# Altium schematic sheet 01_Index.SchDoc
size A4; SheetNumber: 1; SheetTotal: 9
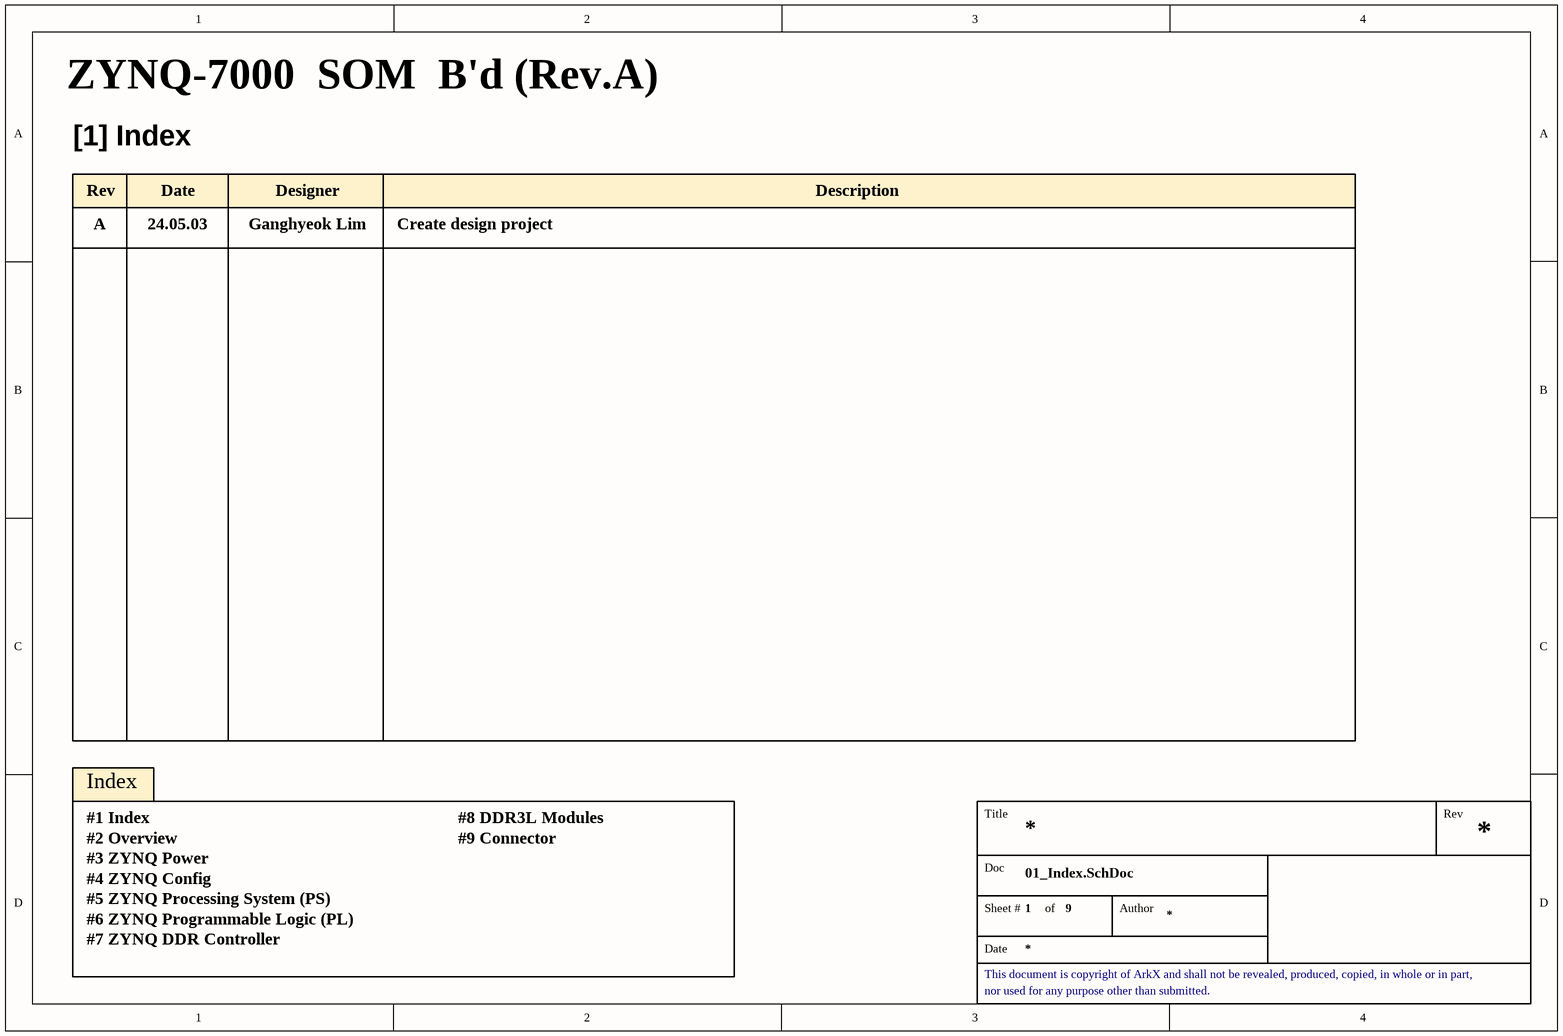
[diagram p0: 01_Index.SchDoc]

## Notes on the sheet
- ZYNQ-7000  SOM  B'd (Rev.A)
- [1] Index
- Rev
- A
- 24.05.03
- Date
- Ganghyeok Lim
- Designer
- Create design project
- Description
- Index
- #1 Index
- #2 Overview
- #8 DDR3L Modules
- #9 Connector
- #3 ZYNQ Power
- #4 ZYNQ Config
- #5 ZYNQ Processing System (PS)
- #6 ZYNQ Programmable Logic (PL)
- #7 ZYNQ DDR Controller
- Title
- Doc
- Sheet #
- of
- Author
- This document is copyright of ArkX and shall not be revealed, produced, copied, in whole or in part,
- nor used for any purpose other than submitted.